# EAGLE design ethernet_jack_cnc_shield (EAGLE 9.5.1)
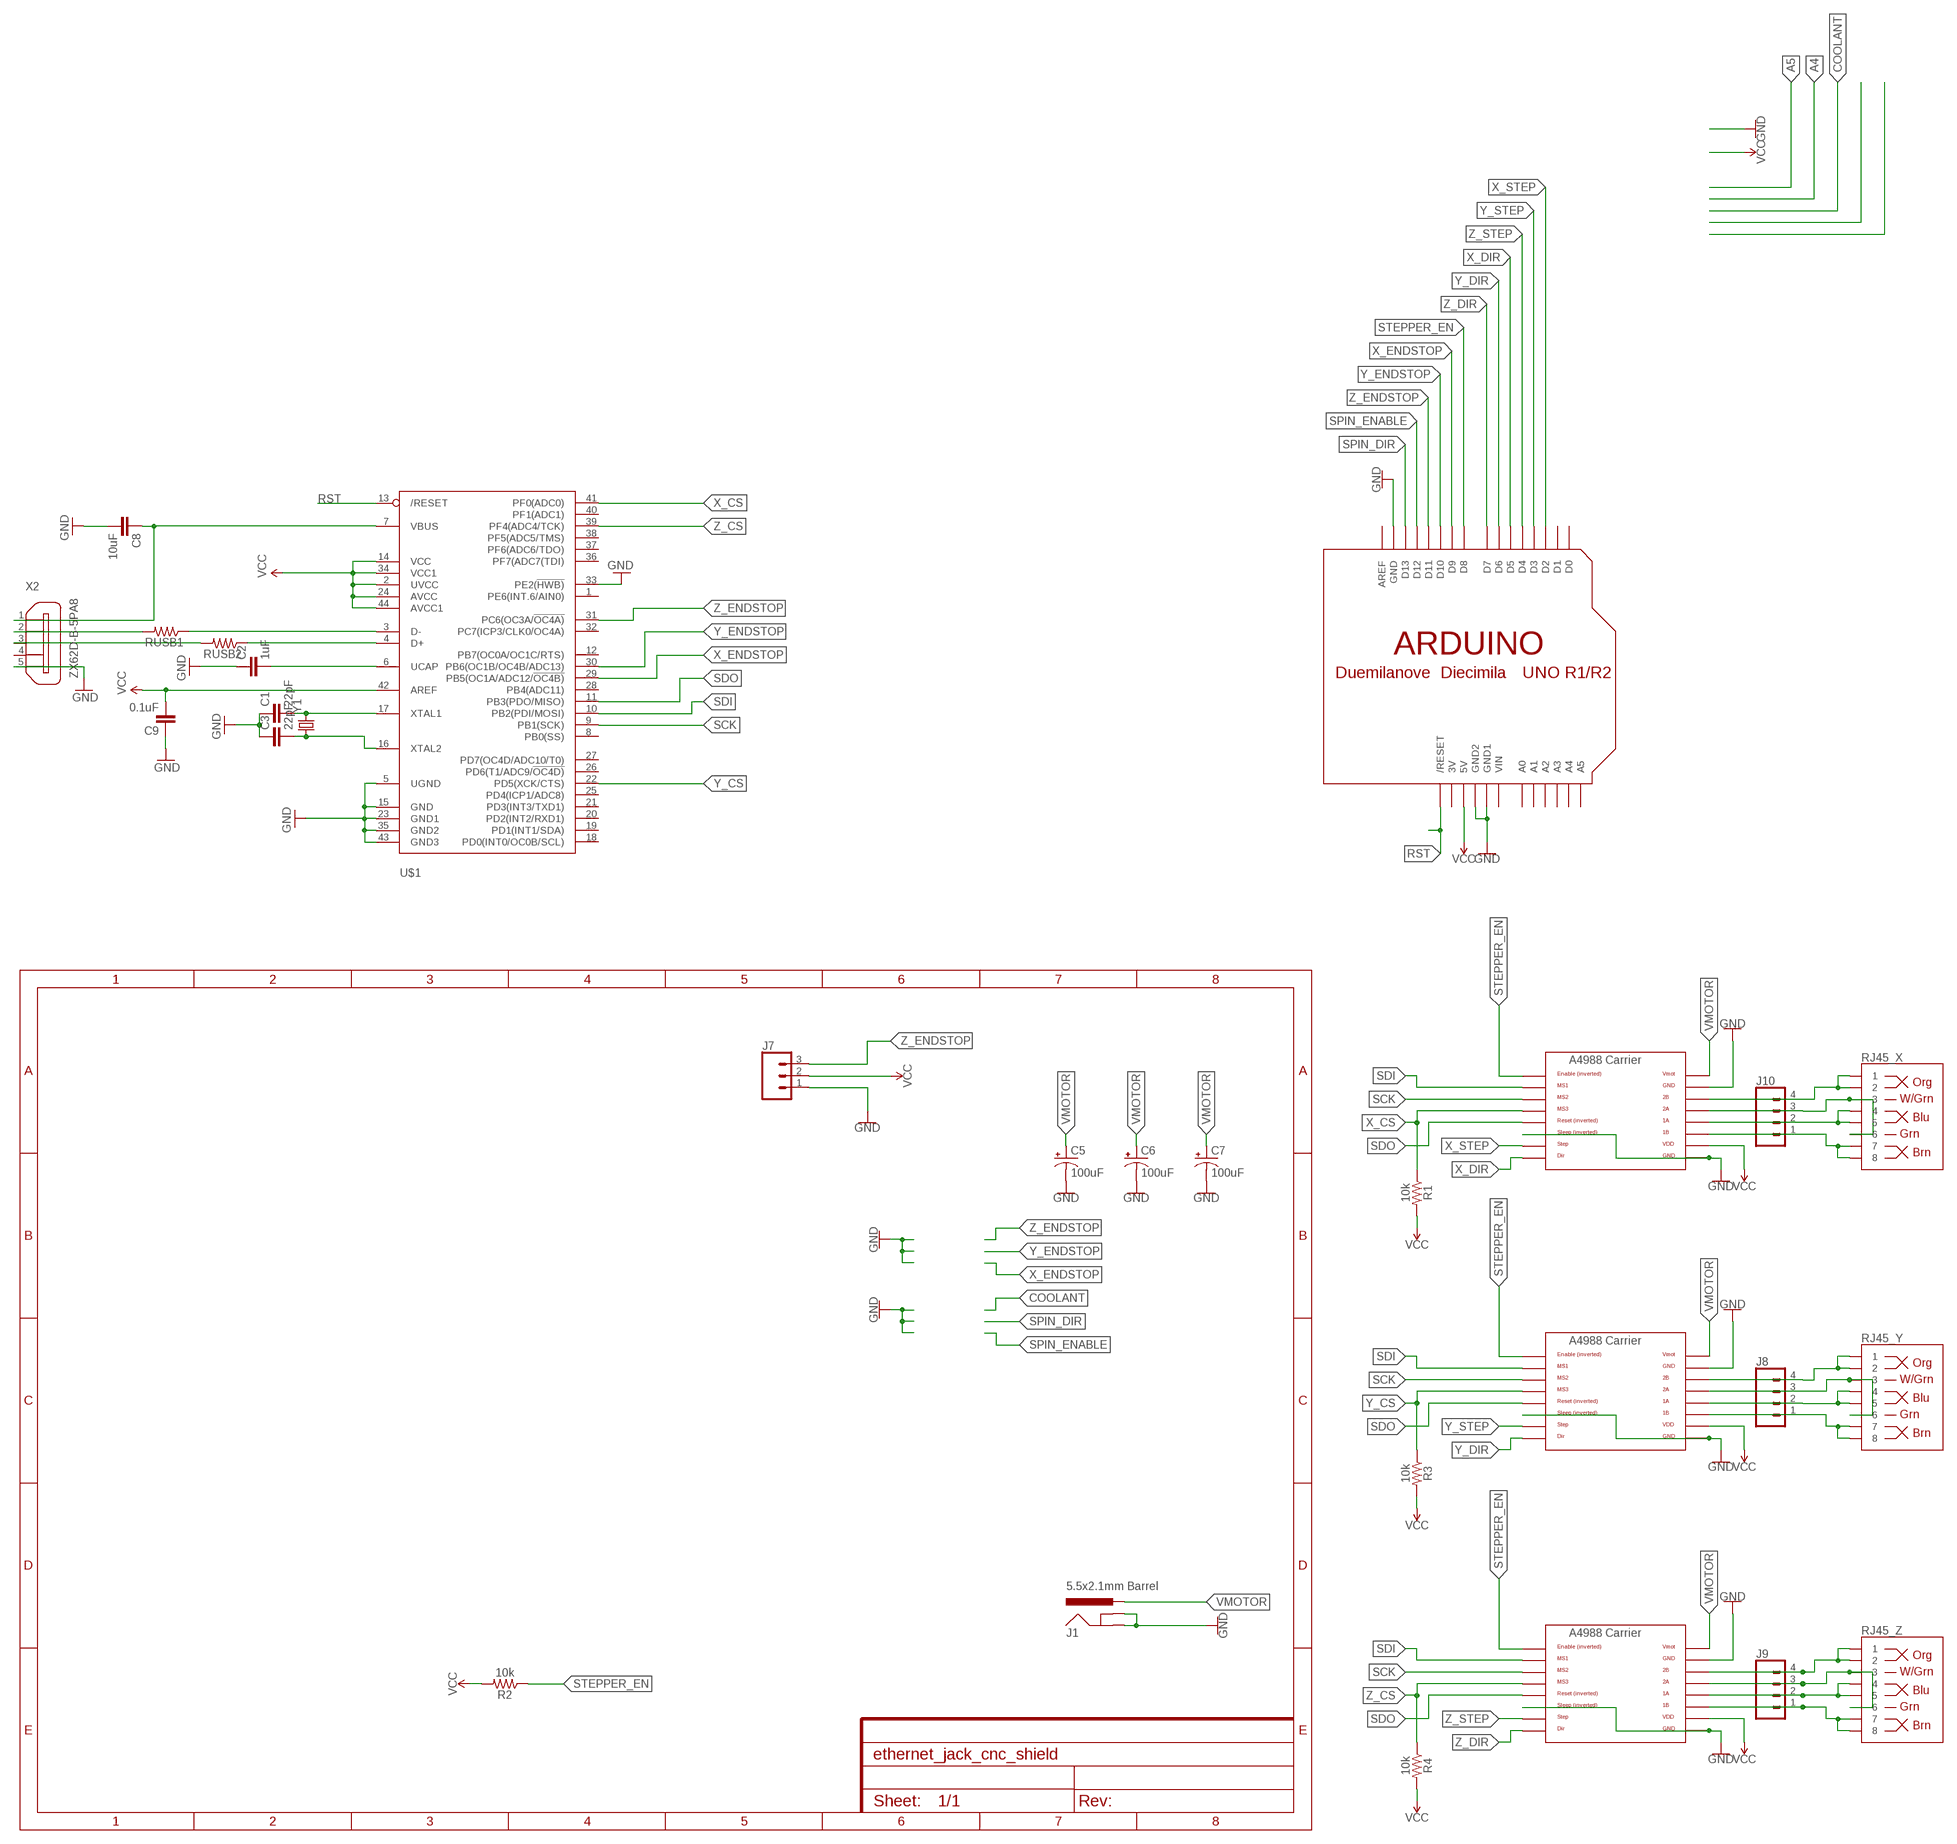
[diagram p0: schematic, sheet 1]

## Parts
C1  22pF  CAP1206  [1206]
C2  1uF  CAP1206  [1206]
C3  22pF  CAP1206  [1206]
C5  100uF  100UF-POLAR-25V-20%(ELEC)  [PANASONIC_D]
C6  100uF  100UF-POLAR-25V-20%(ELEC)  [PANASONIC_D]
C7  100uF  100UF-POLAR-25V-20%(ELEC)  [PANASONIC_D]
C8  10uF  CAP1206  [1206]
C9  0.1uF  CAP1206  [1206]
J1  5.5x2.1mm Barrel  POWER_JACKSMD  [POWER_JACK_SMD]
J7  CONN_03  [1X03]
J8  CONN_04  [1X04]
J9  CONN_04  [1X04]
J10  CONN_04  [1X04]
R1  10k  RESISTOR1206  [1206]
R2  10k  RESISTOR1206  [1206]
R3  10k  RESISTOR1206  [1206]
R4  10k  RESISTOR1206  [1206]
RJ45_X  RJ45  RJ45-8  [RJ45-8]
RJ45_Y  RJ45  RJ45-8  [RJ45-8]
RJ45_Z  RJ45  RJ45-8  [RJ45-8]
RUSB1  RESISTOR1206  [1206]
RUSB2  RESISTOR1206  [1206]
U$1  ATMEGA32U4-AU  [TQFP44]
U$2  A4988BREAKOUT  [A4988BREAKOUT]
U$3  A4988BREAKOUT  [A4988BREAKOUT]
U$4  A4988BREAKOUT  [A4988BREAKOUT]
U$6  ARDUINOUNO  [ARDUINO]
X2  ZX62D-B-5PA8  [ZX62D-B-5PA8]
Y1  CRYSTALCRYSTAL-SMD-5X3-16MHZ  [CRYSTAL-SMD-5X3]

## Nets
GND: C1.1 C2.1 C3.1 C5.- C6.- C7.- C8.2 C9.1 J1.GND(GNDBREAK) J1.P$4(GND) J7.1 U$1.5(UGND) U$1.15(GND) U$1.23(GND1) U$1.33(PE2(!HWB)) U$1.35(GND2) U$1.43(GND3) U$2.GND U$2.GND@0(GND) U$2.SLP(SLEEP) U$3.GND U$3.GND@0(GND) U$3.SLP(SLEEP) U$4.GND U$4.GND@0(GND) U$4.SLP(SLEEP) U$6.GND U$6.GND1 U$6.GND2 X2.5
N$1: J10.4 RJ45_X.1 RJ45_X.2 U$4.2B
N$3: RUSB1.1 U$1.3(D-)
N$4: J10.3 RJ45_X.3 RJ45_X.6 U$4.2A
N$5: RUSB2.1 U$1.4(D+)
N$6: J10.2 RJ45_X.4 RJ45_X.5 U$4.1A
N$7: C2.2 U$1.6(UCAP)
N$8: J10.1 RJ45_X.7 RJ45_X.8 U$4.1B
N$9: C1.2 U$1.17(XTAL1) Y1.3
N$10: C3.2 U$1.16(XTAL2) Y1.1
N$11: RUSB1.2 X2.2
N$12: RUSB2.2 X2.3
N$20: J8.4 RJ45_Y.1 RJ45_Y.2 U$2.2B
N$21: J8.3 RJ45_Y.3 RJ45_Y.6 U$2.2A
N$22: J8.2 RJ45_Y.4 RJ45_Y.5 U$2.1A
N$23: J8.1 RJ45_Y.7 RJ45_Y.8 U$2.1B
N$28: J9.4 RJ45_Z.1 RJ45_Z.2 U$3.2B
N$29: J9.3 RJ45_Z.3 RJ45_Z.6 U$3.2A
N$30: J9.2 RJ45_Z.4 RJ45_Z.5 U$3.1A
N$31: J9.1 RJ45_Z.7 RJ45_Z.8 U$3.1B
RST: U$1.13(/RESET) U$6.RESET(/RESET)
SCK: U$1.9(PB1(SCK)) U$2.MS2 U$3.MS2 U$4.MS2
SDI: U$1.10(PB2(PDI/MOSI)) U$2.MS1 U$3.MS1 U$4.MS1
SDO: U$1.11(PB3(PDO/MISO)) U$2.RST U$3.RST U$4.RST
SPIN_DIR: U$6.D13
SPIN_ENABLE: U$6.D12
STEPPER_EN: R2.1 U$2.EN U$3.EN U$4.EN U$6.D8
VBUS: C8.1 U$1.7(VBUS) X2.1
VCC: C9.2 J7.2 R1.2 R2.2 R3.2 R4.2 U$1.2(UVCC) U$1.14(VCC) U$1.24(AVCC) U$1.34(VCC1) U$1.42(AREF) U$1.44(AVCC1) U$2.VDD U$3.VDD U$4.VDD U$6.5V
VMOTOR: C5.+ C6.+ C7.+ J1.VIN0(PWR) U$2.VMOT U$3.VMOT U$4.VMOT
X_CS: R1.1 U$1.41(PF0(ADC0)) U$4.MS3
X_DIR: U$4.DIR U$6.D5
X_ENDSTOP: U$1.29(PB5(OC1A/ADC12/!OC4B)) U$6.D9
X_STEP: U$4.STEP U$6.D2
Y_CS: R3.1 U$1.22(PD5(XCK/CTS)) U$2.MS3
Y_DIR: U$2.DIR U$6.D6
Y_ENDSTOP: U$1.30(PB6(OC1B/OC4B/ADC13)) U$6.D10
Y_STEP: U$2.STEP U$6.D3
Z_CS: R4.1 U$1.39(PF4(ADC4/TCK)) U$3.MS3
Z_DIR: U$3.DIR U$6.D7
Z_ENDSTOP: J7.3 U$1.31(PC6(OC3A/!OC4A)) U$6.D11
Z_STEP: U$3.STEP U$6.D4
Unconnected: U$1.1(PE6(INT.6/AIN0)) U$1.8(PB0(SS)) U$1.12(PB7(OC0A/OC1C/RTS)) U$1.18(PD0(INT0/OC0B/SCL)) U$1.19(PD1(INT1/SDA)) U$1.20(PD2(INT2/RXD1)) U$1.21(PD3(INT3/TXD1)) U$1.25(PD4(ICP1/ADC8)) U$1.26(PD6(T1/ADC9/!OC4D)) U$1.27(PD7(OC4D/ADC10/T0)) U$1.28(PB4(ADC11)) U$1.32(PC7(ICP3/CLK0/OC4A)) U$1.36(PF7(ADC7(TDI)) U$1.37(PF6(ADC6/TDO)) U$1.38(PF5(ADC5/TMS)) U$1.40(PF1(ADC1)) U$6.A0 U$6.A1 U$6.A2 U$6.A3 U$6.A4 U$6.A5 U$6.AREF U$6.D0 U$6.D1 X2.4 X2.S1 X2.S2 X2.S3 X2.S4

## Power pins joined to a net without a drawn wire
3V: U$6.3V
VIN: U$6.VIN

## Library data of the parts
C1 C3 C8 = SparkFun-Passives:CAP: Capacitor Standard 0603 ceramic capacitor, and 0.1" leaded capacitor.
C2 C9 = SparkFun-Capacitors:CAP: Capacitor Standard 0603 ceramic capacitor, and 0.1" leaded capacitor.
C5-C7 = SparkFun-Capacitors:100UF-POLAR: 100µF polarized capacitors A capacitor is a passive two-terminal electrical component used to store electrical energy temporarily in an electric field.; PROD_ID: CAP-12547
J1 = SparkFun-Connectors:POWER_JACK: Power Jack Connector This is the standard 5.5mm barrel jack for power. The PTH is the most common, proven, reliable, footprint. The Slot footprint only works if the mill layer is transmitted to the PCB fab house so be warned. Here are the connectors we sell at SparkFun: DC Barrel Power Jack/Connector <https://www.sparkfun.com/products/119> (PRT-00119) DC Barrel Power Jack/Connector (SMD) <https://www.sparkfun.com/products/12748> (PRT-12748) DC Barrel Jack Adapter - Breadboard Compatible <https://www.sparkfun.com/products/10811> (PRT-10811) It is used on this SparkFun product (and many, many others): SparkFun RedBoard - Programmed with Arduino <https://www.sparkfun.com/products/12757> (DEV-12757) Also, if you need a mating power supply or connector, please check these out: Wall Adapter Power Supply - 9VDC 650mA <https://www.sparkfun.com/products/298> (TOL-00298) DC Barrel Jack Adapter - Male <https://www.sparkfun.com/products/10287> (PRT-10287); PROD_ID: CONN-08106; SF_ID: PRT-12748
J7 = SparkFun-Connectors:CONN_03: Multi connection point. Often used as Generic Header-pin footprint for 0.1 inch spaced/style header connections On any of the 0.1 inch spaced packages, you can populate with these: Break Away Headers - Straight <https://www.sparkfun.com/products/116> (PRT-00116) Break Away Male Headers - Right Angle <https://www.sparkfun.com/products/553> (PRT-00553) Female Headers <https://www.sparkfun.com/products/115> (PRT-00115) Break Away Headers - Machine Pin <https://www.sparkfun.com/products/117> (PRT-00117) Break Away Female Headers - Swiss Machine Pin <https://www.sparkfun.com/products/743> (PRT-00743) Stackable Header - 3 Pin (Female, 0.1") <https://www.sparkfun.com/products/13875> (PRT-13875) For SCREWTERMINALS and SPRING TERMINALS visit here: Screw Terimnals on SparkFun.com <https://www.sparkfun.com/search/results?term=Screw+Terminals> (5mm/3.5mm/2.54mm spacing) This device is also useful as a general connection point to wire up your design to another part of your project. Our various solder wires solder well into these plated through hole pads. Hook-Up Wire - Assortment (Stranded, 22 AWG) <https://www.sparkfun.com/products/11375> (PRT-11375) Hook-Up Wire - Assortment (Solid Core, 22 AWG) <https://www.sparkfun.com/products/11367> (PRT-11367) View the entire wire category on our website here <https://www.sparkfun.com/categories/141> Special notes: Molex polarized connector foot print use with SKU : PRT-08232 with associated crimp pins and housings.
J8-J10 = SparkFun-Connectors:CONN_04: Multi connection point. Often used as Generic Header-pin footprint for 0.1 inch spaced/style header connections On any of the 0.1 inch spaced packages, you can populate with these: Break Away Headers - Straight <https://www.sparkfun.com/products/116> (PRT-00116) Break Away Male Headers - Right Angle <https://www.sparkfun.com/products/553> (PRT-00553) Female Headers <https://www.sparkfun.com/products/115> (PRT-00115) Break Away Headers - Machine Pin <https://www.sparkfun.com/products/117> (PRT-00117) Break Away Female Headers - Swiss Machine Pin <https://www.sparkfun.com/products/743> (PRT-00743) For SCREWTERMINALS and SPRING TERMINALS visit here: Screw Terimnals on SparkFun.com <https://www.sparkfun.com/search/results?term=Screw+Terminals> (5mm/3.5mm/2.54mm spacing) This device is also useful as a general connection point to wire up your design to another part of your project. Our various solder wires solder well into these plated through hole pads. Hook-Up Wire - Assortment (Stranded, 22 AWG) <https://www.sparkfun.com/products/11375> (PRT-11375) Hook-Up Wire - Assortment (Solid Core, 22 AWG) <https://www.sparkfun.com/products/11367> (PRT-11367) View the entire wire category on our website here <https://www.sparkfun.com/categories/141> Special notes: Molex polarized connector foot print use with SKU : PRT-08231 with associated crimp pins and housings. 1MM SMD Version SKU: PRT-10208; PROD_ID: CONN-09696
R1-R4 = SparkFun-Resistors:RESISTOR: Generic Resistor Package
RJ45_X RJ45_Y RJ45_Z = SparkFun-Connectors:RJ45-8: RJ45 Jack - 8 pin Simple RJ45, 8-pin connection. Commonly used for Cat5, Cat5e, and Cat6 Ethernet cables. Here is the connector we sell at SparkFun: RJ45 8-Pin Connector <https://www.sparkfun.com/products/643> (PRT-00643) Datasheet <https://cdn.sparkfun.com/datasheets/Prototyping/04908.pdf> It is used on this SparkFun product: SparkFun RJ45 Breakout <https://www.sparkfun.com/products/716> (BOB-00716) Note, you may also be interested in the "MAGJACK" version of this. It is basically a RJ45 connector, but also has some status LEDs built into the connector housing. You can check that out in this library at the device named "MAGJACK.dev" and see these products online: RJ45 Ethernet MagJack-Compatible <https://www.sparkfun.com/products/8534> (PRT-08534) SparkFun RJ45 MagJack Breakout <https://www.sparkfun.com/products/13021> (BOB-13021); PROD_ID: CONN-08506; SF_ID: PRT-00643
RUSB1 RUSB2 = SparkFun-Passives:RESISTOR: Resistor Basic schematic elements and footprints for 0603, 1206, and PTH resistors.
U$1 = adafruit:ATMEGA32U4: http://www.ladyada.net/library/eagle
U$2-U$4 = RepRapjr:A4988BREAKOUT
U$6 = adafruit_volzo:ARDUINO: Arduino Diecimila/Duemilanove Make a shield with ease, this package has all the named pins as well as the two mounting drill holes and an outline of the USB and DC power connector. The outline is on the DIMENSION layer, so if your board house uses it they will cut the outline to match. http://www.ladyada.net/library/pcb/eaglelibrary.html
X2 = zx62d-b-5pa8-oshpark_10:ZX62D-B-5PA8: Micro USB Type B Connector - Standard, Shell Through Hole Source: http://www.hirose.co.jp/cataloge_hp/ed_ZX_20140804.pdf; MF: Hirose; MPN: ZX62D-B-5PA8; OC_FARNELL: 2300438; OC_NEWARK: 69W0712
Y1 = SparkFun-FreqCtrl:CRYSTAL: Various standard crystals. Proven footprints.; PROD_ID: XTAL-08218

## Net classes
1 power: width 0.381 mm, clearance 0.254 mm

## Board
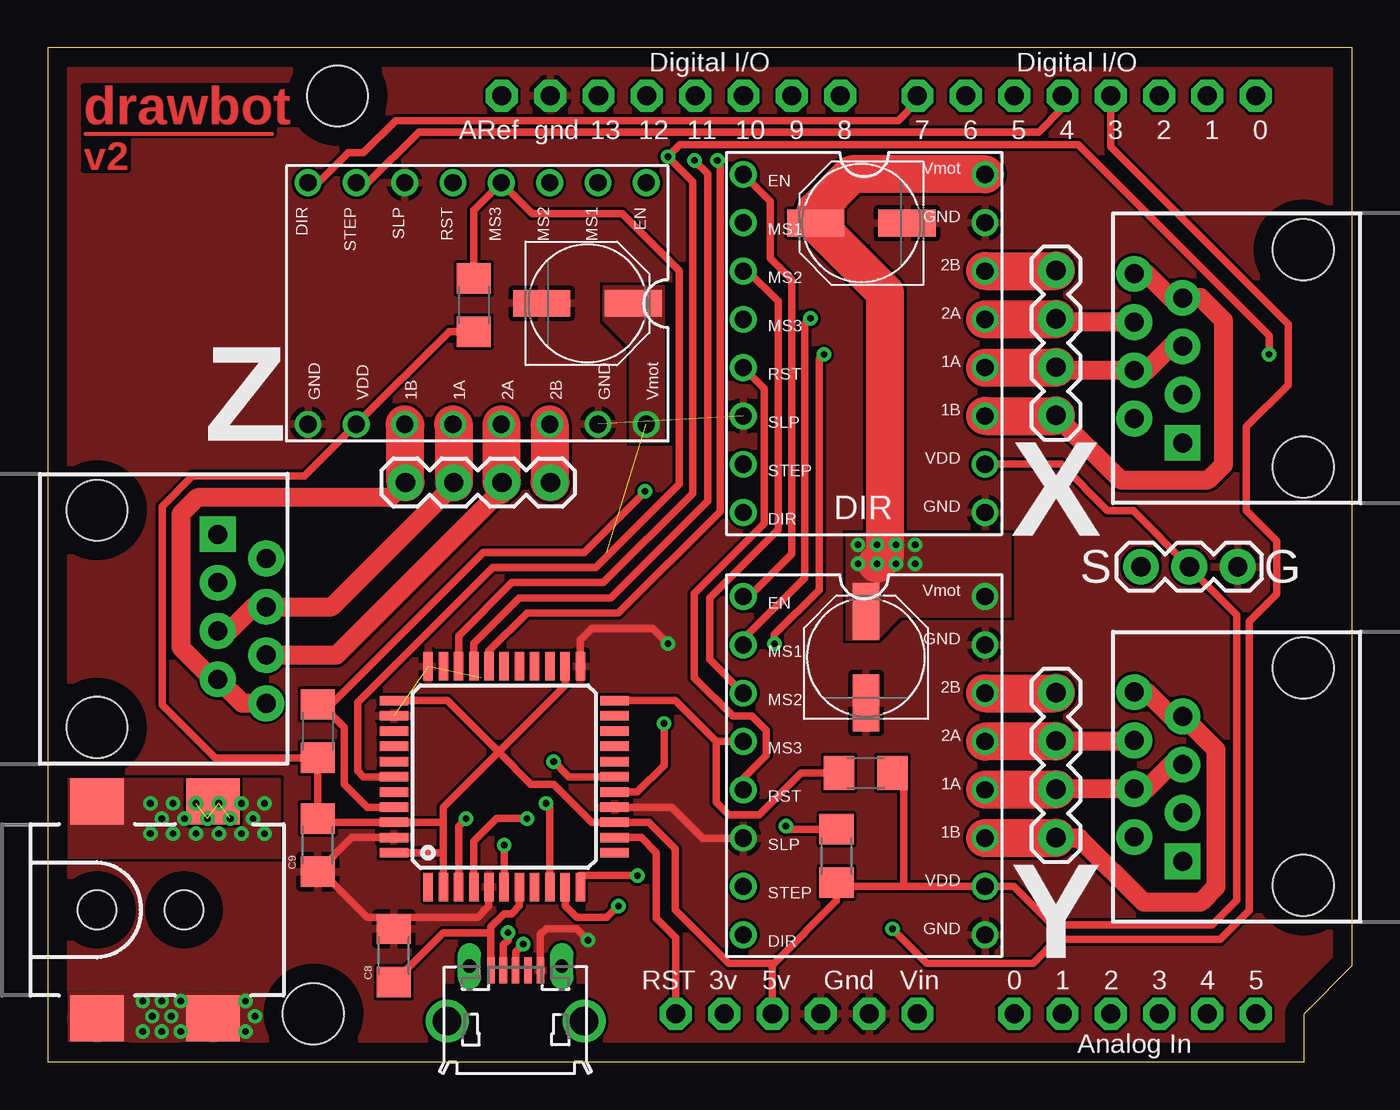
[diagram p1: board, top side]
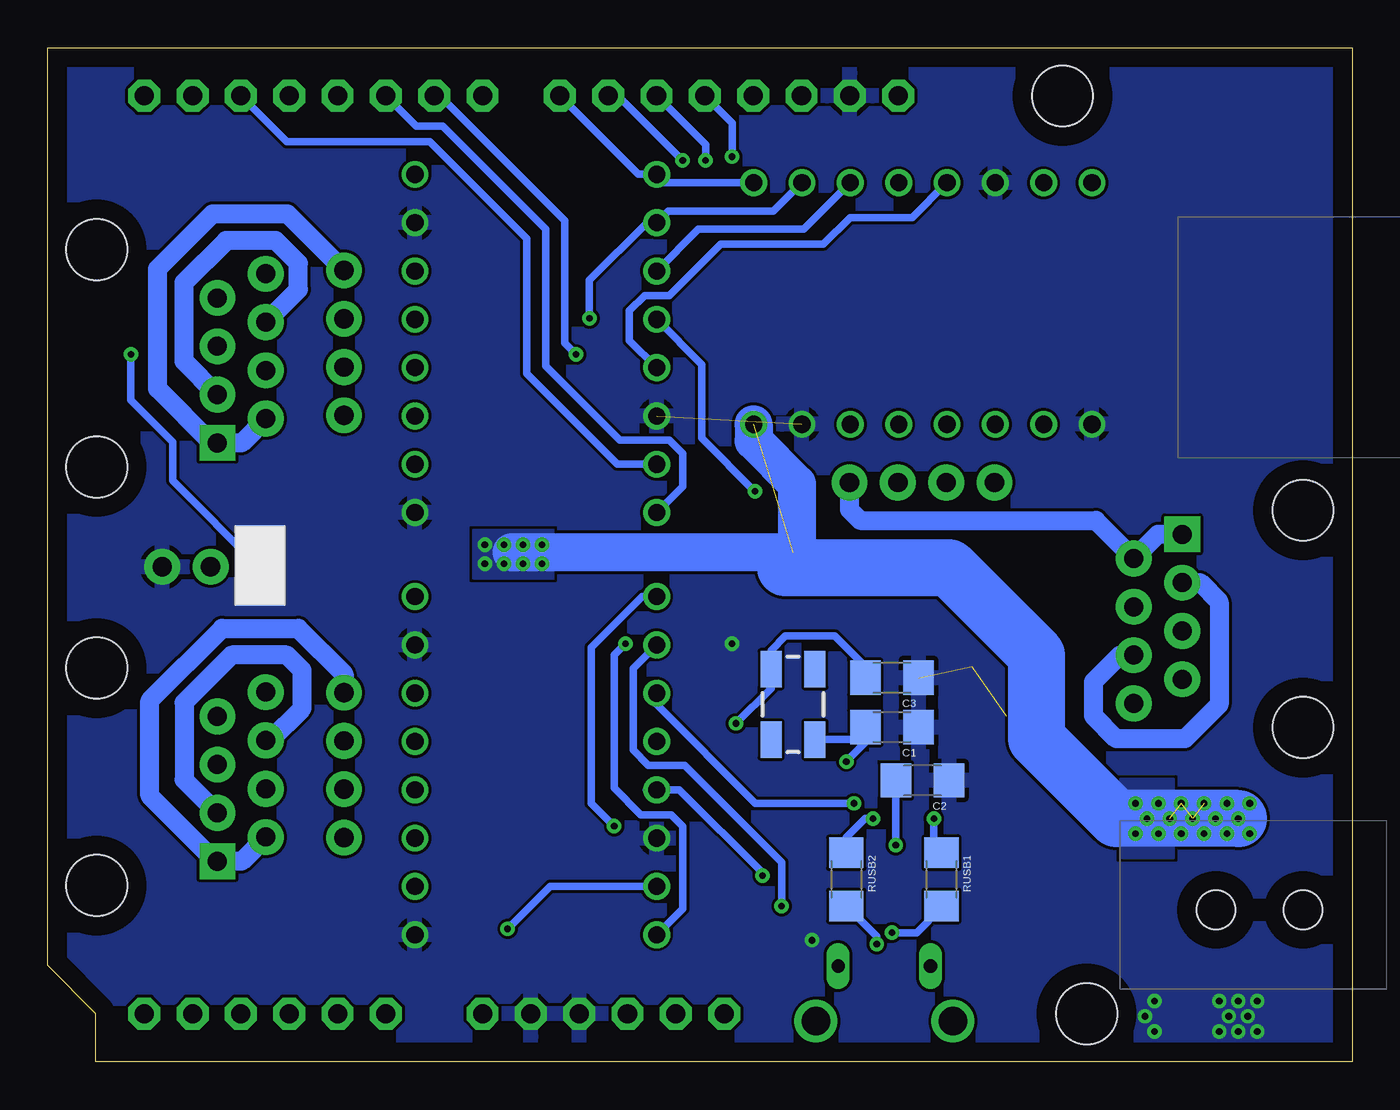
[diagram p2: board, bottom side, seen from below]

Size 68.58 x 53.34 mm. Coordinates in mm from the lower left corner, seen from the top.
Copper layers (1*16): Top 0.035mm / dielectric 1.5mm / Bottom 0.035mm
Design rules "default": minimum track width 6mil, minimum drill 0.35mm, track to track 6mil, track to pad 6mil, pad to pad 6mil, via to via 6mil, smd to smd 6mil, copper to edge 40mil, drill to drill 6mil, minimum pad ring 10mil, minimum via ring 8mil, stop-mask expansion 4mil, vias tented up to drill 0mil, thermal gap 10mil

### Footprints (pad centres in the part's own frame; a part is rotated, then mirrored left to right if it is on the bottom)
1206 = smd 1.6 x 1.8: 1 -1.4,0; 2 1.4,0
PANASONIC_D = smd 3 x 1.4: + 2.4,0; - -2.4,0
POWER_JACK_SMD = smd 2.8 x 2.4: GND 0,-5.7; P$4 6.1,-5.7; VIN0 0,5.7; VIN1 6.1,5.7 | hole 2.032: 0,0; 4.572,0
1X03 = drill 1.016 pad 1.88: 1 0,0; 2 2.54,0; 3 5.08,0
1X04 = drill 1.016 pad 1.88: 1 0,0; 2 2.54,0; 3 5.08,0; 4 7.62,0
RJ45-8 = drill 1 pad 1.88 square: 1 -4.445,6.35 | drill 1 pad 1.88: 2 -3.175,8.89; 3 -1.905,6.35; 4 -0.635,8.89; 5 0.635,6.35; 6 1.905,8.89; 7 3.175,6.35; 8 4.445,8.89 | hole 3.2: -5.715,0; 5.715,0
TQFP44 = smd 1.5 x 0.5: 1 -5.8,4; 2 -5.8,3.2; 3 -5.8,2.4; 4 -5.8,1.6; 5 -5.8,0.8; 6 -5.8,0; 7 -5.8,-0.8; 8 -5.8,-1.6; 9 -5.8,-2.4; 10 -5.8,-3.2; 11 -5.8,-4; 23 5.8,-4; 24 5.8,-3.2; 25 5.8,-2.4; 26 5.8,-1.6; 27 5.8,-0.8; 28 5.8,0; 29 5.8,0.8; 30 5.8,1.6; 31 5.8,2.4; 32 5.8,3.2; 33 5.8,4 | smd 0.5 x 1.5: 12 -4,-5.8; 13 -3.2,-5.8; 14 -2.4,-5.8; 15 -1.6,-5.8; 16 -0.8,-5.8; 17 0,-5.8; 18 0.8,-5.8; 19 1.6,-5.8; 20 2.4,-5.8; 21 3.2,-5.8; 22 4,-5.8; 34 4,5.8; 35 3.2,5.8; 36 2.4,5.8; 37 1.6,5.8; 38 0.8,5.8; 39 0,5.8; 40 -0.8,5.8; 41 -1.6,5.8; 42 -2.4,5.8; 43 -3.2,5.8; 44 -4,5.8
A4988BREAKOUT = drill 0.9: 1A 8.89,1.27; 1B 11.43,1.27; 2A 6.35,1.27; 2B 3.81,1.27; DIR 16.51,-11.43; EN -1.27,-11.43; GND 16.51,1.27; GND@0 1.27,1.27; MS1 1.27,-11.43; MS2 3.81,-11.43; MS3 6.35,-11.43; RST 8.89,-11.43; SLP 11.43,-11.43; STEP 13.97,-11.43; VDD 13.97,1.27; VMOT -1.27,1.27
ARDUINO = drill 1 pad 1.676 octagon: 3V 35.56,2.54; 5V 38.1,2.54; A0 50.8,2.54; A1 53.34,2.54; A2 55.88,2.54; A3 58.42,2.54; A4 60.96,2.54; A5 63.5,2.54; AREF 23.876,50.8; D0 63.5,50.8; D1 60.96,50.8; D2 58.42,50.8; D3 55.88,50.8; D4 53.34,50.8; D5 50.8,50.8; D6 48.26,50.8; D7 45.72,50.8; D8 41.656,50.8; D9 39.116,50.8; D10 36.576,50.8; D11 34.036,50.8; D12 31.496,50.8; D13 28.956,50.8; GND 26.416,50.8; GND1 43.18,2.54; GND2 40.64,2.54; RESET 33.02,2.54; VIN 45.72,2.54 | hole 3.2: 15.24,50.8; 13.97,2.54
ZX62D-B-5PA8 = smd 1.35 x 0.4: 1 4.825,1.3; 2 4.825,0.65; 3 4.825,0; 4 4.825,-0.65; 5 4.825,-1.3 | drill 1.5: S1 2.15,-3.6; S2 2.15,3.6 | drill 0.7 long: S3 5.05,2.425; S4 5.05,-2.425
CRYSTAL-SMD-5X3 = smd 1.9 x 1.1: 1 -1.85,-1.15; 2 1.85,-1.15; 3 1.85,1.15; 4 -1.85,1.15

### Placement (x,y rotation side)
C1  24.2,17.6 180 bottom
C2  22.6,14.8 180 bottom
C3  24.2,20.2 180 bottom
C5  42.77,44.11 180 top
C6  28.38,39.89 0 top
C7  43.01,21.28 90 top
C8  18.2,5.6 90 top
C9  14.2,11.4 90 top
J1  2.6,8 0 top
J7  62.55,26.04 180 top
J8  53,11.8 90 top
J9  18.81,30.47 0 top
J10  53,34 90 top
R1  14.2,17.4 270 top
R2  41.46,10.84 270 top
R3  43,15.2 0 top
R4  22.4,39.8 270 top
RJ45_X  66,37 90 top
RJ45_Y  66,15 90 top
RJ45_Z  2.6,23.3 270 top
RUSB1  21.6,9.6 270 bottom
RUSB2  26.6,9.6 270 bottom
U$1  24,15 90 top
U$2  48,23.2 270 top
U$3  30.2,34.8 180 top
U$4  48,45.4 270 top
U$6  0,0 0 top
X2  24.6,0 90 top
Y1  29.4,18.8 270 bottom

### Tracks (layer width: path | path; a pad name or v marks a point on that pad's centre or on a via)
GND  (via drill 0.35)  (3 unrouted)
  Top 0.4: X2.5 25.9,6.7 26.2,7 27.8,7 v28.4,6.4 | U$1.43 16,11.8 C9.1 | U$1.5 23.2,8.2 22.6,7.6 18.8,7.6 C8.2 17.6,7.6 16.8,7.6 14.4,10 C9.1 | C9.1 13.6,10 | U$1.23 28,22.2 28.6,22.8 31.8,22.8 v32.6,22 | U$1.15 32.8,13.4 34.43,11.77 U$2.SLP
  other vias: 5,1.6 5,3.2 6,1.6 6,3.2 7,3.2 7,1.6 5.5,2.4 6.5,2.4 10.4,1.6 10.4,3.2 10.9,2.4
  pour Bottom (rank 2): 0,0 69.2,0 69.2,53.6 0,53.6
  pour Top (no thermals): 1.1,3.7 11.5,3.7 11.5,1.1 1.1,1.1
  pour Top (rank 2): 0.2,0 68.6,0 68.8,0.2 68.8,53 68.6,53.2 0.4,53.2 0.2,53.4
N$1
  Top 2: U$4.2B 52.97,41.59 J10.4
  Bottom 1: J10.4 55.98,44.6 59.91,44.6 62.8,41.71 62.8,35.4 59.95,32.55 RJ45_X.1 58.38,32.55 RJ45_X.2
N$2
  Top 0.2: 2,48.8 11.8,48.8
N$3  (via drill 0.35)
  Top 0.4: U$1.3 21.6,12.4 v22,12.8
  Bottom 0.4: RUSB1.1 22,11.4 v22,12.8
N$4
  Top 1: RJ45_X.6 53.12,38.91 52.97,39.05
  Top 2: U$4.2A 52.97,39.05 J10.3
  Bottom 1: RJ45_X.6 55.4,40.62 55.4,42 56.6,43.2 59.2,43.2 61.4,41 61.4,36.84 RJ45_X.3
N$5  (via drill 0.35)
  Top 0.4: v25.2,12.8 23.6,12.8 22.4,11.6 U$1.4
  Bottom 0.4: v25.2,12.8 25.6,12.8 26.6,11.8 RUSB2.1
N$6
  Top 1: 52.97,36.51 53.12,36.37 RJ45_X.4 57.78,36.37 59.05,37.63 RJ45_X.5
  Top 2: U$4.1A 52.97,36.51 J10.2
N$7  (via drill 0.35)
  Top 0.4: U$1.6 v24,11.4
  Bottom 0.4: v24,11.4 C2.2
N$8
  Top 1: J10.1 56.4,30.6 61,30.6 61.8,31.4 61.8,39 60.6,40.2 59.67,40.2 RJ45_X.7 59.05,40.17 57.78,41.45 RJ45_X.8
  Top 2: U$4.1B 52.97,33.97 J10.1
N$9  (via drill 0.35)
  Top 0.4: U$1.17 27.4,15 v26.6,15.8
  Bottom 0.4: Y1.3 26.25,16.95 C1.2 25.6,16.8 v26.6,15.8
N$10  (via drill 0.35)
  Top 0.4: U$1.16 31,14.2 32.4,15.6 v32.4,17.8
  Bottom 0.4: C3.2 25.6,20.8 27.2,22.4 29.8,22.4 30.55,21.65 Y1.1 30.55,19.65 v32.4,17.8
N$11  (via drill 0.35)
  Top 0.4: v24.2,6.8 24.2,6.4 23.95,6.15 X2.2
  Bottom 0.4: v24.2,6.8 22.9,6.8 21.6,8.1 RUSB1.2
N$12  (via drill 0.35)
  Top 0.4: X2.3 24.6,5.8 v25,6.2
  Bottom 0.4: v25,6.2 25,6.6 RUSB2.2
N$20
  Top 2: U$2.2B 52.97,19.39 J8.4
  Bottom 1: RJ45_Y.2 58.38,10.55 RJ45_Y.1 59.76,10.55 63.2,14 63.2,19 59.4,22.8 55.4,22.8 53,20.4 J8.4
N$21
  Top 1: RJ45_Y.6 57.05,16.85 52.97,16.85
  Top 2: J8.3 52.97,16.85 U$2.2A
  Bottom 1: RJ45_Y.6 56.9,16.91 55.2,18.6 55.2,20.6 56,21.4 58.9,21.4 61.4,18.9 61.4,14.85 RJ45_Y.3
N$22
  Top 1: J8.2 53.02,14.37 RJ45_Y.4 57.78,14.37 59.05,15.63 RJ45_Y.5
  Top 2: J8.2 52.97,14.31 U$2.1A
N$23
  Top 1: RJ45_Y.8 57.78,19.45 59.05,18.18 RJ45_Y.7 61.4,16.43 61.4,9.2 60.6,8.4 57.6,8.4 54.23,11.77 52.97,11.77
  Top 2: J8.1 52.97,11.77 U$2.1B
N$28
  Top 2: U$3.2B 26.39,30.51 J9.4
  Bottom 1: J9.4 26.43,29.03 25.88,28.48 13.49,28.48 RJ45_Z.2 10.22,27.75 RJ45_Z.1
N$29
  Top 1: 23.89,29.86 J9.3 | RJ45_Z.6 15.2,21.39 23.85,30.05 23.85,30.51
  Top 2: U$3.2A 23.85,30.51 J9.3
  Bottom 1: RJ45_Z.3 8.01,25.2 7,24.2 7,18.8 8.8,17 12.4,17 13.6,18.2 13.6,20 12.21,21.39 RJ45_Z.6
N$30
  Top 1: 21.35,30.15 J9.2 21.4,30.42 21.4,30.4 14.94,23.93 RJ45_Z.4 10.82,23.93 9.55,22.66 RJ45_Z.5
  Top 2: U$3.1A 21.35,33.49 J9.2
N$31
  Top 1: J9.1 18.01,29.67 7.87,29.67 7,28.8 7,21.8 8.68,20.12 RJ45_Z.7 10.22,18.86 RJ45_Z.8
  Top 2: J9.1 18.81,33.49 U$3.1B
RST
  Top 0.4: U$1.13 31.2,11.8 32,11 32,7.56 33.02,6.54 U$6.RESET
SCK  (via drill 0.35)
  Top 0.4: U$4.MS2 36.81,41.59 38.4,40 38.4,28 34.8,24.4 34.8,21.16 U$2.MS2 | v26.2,13.6 26.4,13.4 U$1.9
  Bottom 0.4: U$2.MS2 36.57,18.79 31.38,13.6 v26.2,13.6 | U$4.MS2 34.37,43.79 28.83,43.79 U$3.MS2
SDI  (via drill 0.35)
  Top 0.4: v40.1,39.1 39.8,38.8 39.8,25.46 36.57,22.23 U$2.MS1 | U$1.10 27.2,8.2 27.8,7.6 29.4,7.6 v30,8.2
  Bottom 0.4: U$2.MS1 37.8,20.7 37.8,16.4 37,15.6 35.1,15.6 30,10.5 v30,8.2 | v40.1,39.1 40.1,41.1 37.07,44.13 U$4.MS1 35.97,44.73 30.43,44.73 U$3.MS1
SDO  (via drill 0.35)
  Top 0.4: v31,9.8 28,9.8 U$1.11 | U$2.RST 36.57,14.91 37.77,16.11 37.77,17.43 37,18.2 36,18.2 34,20.2 34,24.64 37.67,28.31 37.67,35.41 U$4.RST
  Bottom 0.4: 37.11,14.31 U$2.RST 35.37,14.31 31,9.94 v31,9.8 | U$3.RST 23.14,44.4 26.4,44.4 27.8,43 33.2,43 35.9,40.3 37.2,40.3 38,39.5 38,37.94 U$4.RST
STEPPER_EN  (via drill 0.35)
  Top 0.4: U$2.EN 36.87,24.47 39.1,26.7 39.1,41.14 37.97,42.27 37.97,45.27 U$4.EN | v38.8,12.4 38.96,12.24 R2.1
  Bottom 0.4: U$6.D8 37.53,46.67 U$4.EN 36.13,46.23 U$3.EN | 36.44,24.34 U$2.EN 37.33,24.47 40,21.8 40,13.6 v38.8,12.4
VBUS
  Top 0.4: U$1.7 24.8,8.2 24.4,7.8 24,7.8 23.3,7.1 23.3,6.8 | 23.3,6.8 X2.1 | C8.1 20.8,6.8 23.3,6.8
VCC
  Top 0.4: U$1.2 20.8,11 | 20.8,11 20.8,12.6 | U$1.44 20.8,11 | 20.8,12.6 U$1.42 14.4,12.6 C9.2 R1.2 8.8,16 6.02,18.78 6.02,29.2 7.62,30.8 13.5,30.8 U$3.VDD 21.1,38.4 R4.2 | U$1.24 27.2,19.8 23.7,16.3 | 23.7,16.3 20.8,13.4 20.8,12.6 | U$1.34 21,19 23.7,16.3 | U$4.VDD 53.27,31.43 55.7,29 57.05,29 J7.2 60.01,25.99 62.5,23.5 62.5,8.5 61.2,7.2 52.8,7.2 50.77,9.23 U$2.VDD 45,9.23 | 41.79,10.03 41.52,9.55 | 41.52,9.55 R2.2 41.46,8.46 38.2,5.2 | 38.2,5.2 35.8,5.2 33,8 33,11.2 31.6,12.6 U$1.14 28.6,12.6 26.6,14.6 25.4,14.6 23.7,16.3 | U$6.5V 38.1,5.1 38.2,5.2 | 41.52,9.55 41.85,9.23 45,9.23 | R3.2 45,14.6 45,9.23
VMOTOR  (via drill 0.35)  (4 unrouted)
  Top 2: U$4.VMOT 42.27,46.67 40.37,44.77 C5.+ 44,40.48 44,26.6 v43.6,26.2
  Bottom 2: U$3.VMOT 31.47,32.67 29.2,30.4 29.2,26.6 29.8,26 | 29.4,26.8 44.2,26.8
  Bottom 3: v6,12.8 12.4,12.8 16.6,17 16.6,21.4 21.2,26 29.8,26
  other vias: 10.8,12.8 11.4,12 10.2,12 10.2,13.6 11.4,13.6 42.6,27.2 42.6,26.2 43.6,27.2 44.6,27.2 44.6,26.2 45.6,27.2 45.6,26.2 9.6,12.8 9,13.6 9,12 8.4,12.8 7.8,13.6 7.8,12 6.6,13.6 6.6,12 7.2,12.8 5.4,12 5.4,13.6
  pour Top (no thermals): 0.8,14.9 12.2,14.9 12.2,10.7 0.8,10.7
  pour Bottom (no thermals): 9.4,14.9 9.4,10.7 12.2,10.7 12.2,14.9
  pour Top (no thermals): 50.6,25.6 50.6,23.4 44.8,23.4 43.6,22.2 42,22.2 42,27.8 50.6,27.8
  pour Bottom: 42,28 42,25.4 46.2,25.4 46.2,28
  pour Top (no thermals): 30.6,32.6 32.4,32.6 32.4,40.8 29.2,40.8 29.2,39 30.6,37.6
X_CS  (via drill 0.35)
  Top 0.4: v31.4,30 28.2,26.8 22.9,26.8 14.9,18.8 R1.1 14.4,18.8 15.6,17.6 15.6,14.6 16.8,13.4 U$1.41
  Bottom 0.4: U$4.MS3 34.2,36.68 34.2,32.8 v31.4,30
X_DIR
  Bottom 0.4: U$4.DIR 35.2,30.26 35.2,32 35.9,32.7 38.5,32.7 42.4,36.6 42.4,43.8 47.8,49.2 49.2,49.2 U$6.D5
X_ENDSTOP  (via drill 0.35)
  Top 0.4: U$1.29 23.2,21.6 25.2,23.6 30,23.6 35.35,28.95 35.35,47.25 v35.2,47.4
  Bottom 0.4: v35.2,47.4 38.6,50.8 U$6.D9
X_STEP
  Bottom 0.4: U$6.D2 56.02,48.4 48.5,48.4 43.4,43.3 43.4,36.2 38.63,31.43 U$4.STEP
Y_CS
  Top 0.4: U$2.MS3 35.15,16.85 | 35.15,16.85 33,19 U$1.22 | 35.15,16.85 35.15,13.65 35.8,13 37.4,13 39.6,15.2 R3.1
Y_DIR  (via drill 0.35)
  Top 0.4: v40.8,37.2 40.55,36.95 40.55,24.83 38.2,22.48 v38.2,22
  Bottom 0.4: U$6.D6 47.96,50.8 41.4,44.24 41.4,37.8 v40.8,37.2 | U$2.DIR 35.2,8.06 35.2,12.4 35.8,13 37.4,13 38.8,14.4 38.8,21.4 v38.2,22
Y_ENDSTOP  (via drill 0.35)
  Top 0.4: U$1.30 22.4,22 24.8,24.4 29.6,24.4 34.7,29.5 34.7,46.7 v34,47.4
  Bottom 0.4: v34,47.4 34,48.22 U$6.D10
Y_STEP  (via drill 0.35)
  Top 0.4: v44.4,7 46.2,5.2 51.8,5.2 53.05,6.45 61.63,6.45 63.15,7.97 63.15,23.15 64.6,24.6 64.6,27.4 63,29 63,33.4 65.2,35.6 65.2,38.8 55.88,48.12 U$6.D3
  Bottom 0.4: v44.4,7 42.17,9.23 U$2.STEP
Z_CS
  Top 0.4: R4.1 22.4,44.78 U$3.MS3 25.48,44.6 30.2,44.6 33.2,41.6 33.2,30.4 28.8,26 23.4,26 16.3,18.9 16.3,15.3 16.6,15 U$1.39
Z_DIR
  Top 0.4: U$3.DIR 14.23,46.23 15.8,47.8 16.6,47.8 18.3,49.5 44.7,49.5 45.72,50.52 U$6.D7
Z_ENDSTOP  (via drill 0.35)
  Top 0.4: U$1.31 21.6,22.4 24.4,25.2 29.2,25.2 33.9,29.9 33.9,46.3 v32.6,47.6 33.23,48.23 54.17,48.23 64.2,38.2 v64.2,37.2
  Bottom 0.4: v32.6,47.6 32.6,49.36 U$6.D11 | J7.3 62,30.57 62,32.6 64.2,34.8 v64.2,37.2
Z_STEP
  Top 0.4: U$3.STEP 16.83,46.23 19.5,48.9 52.1,48.9 53.34,50.14 U$6.D4

### Text on the board
Top: drawbot | v2
tPlace: Z | DIR | X | S | G | Y
tKeepout: drawbot | v2